# EAGLE schematic v847_redraw (EAGLE 9.6.0)
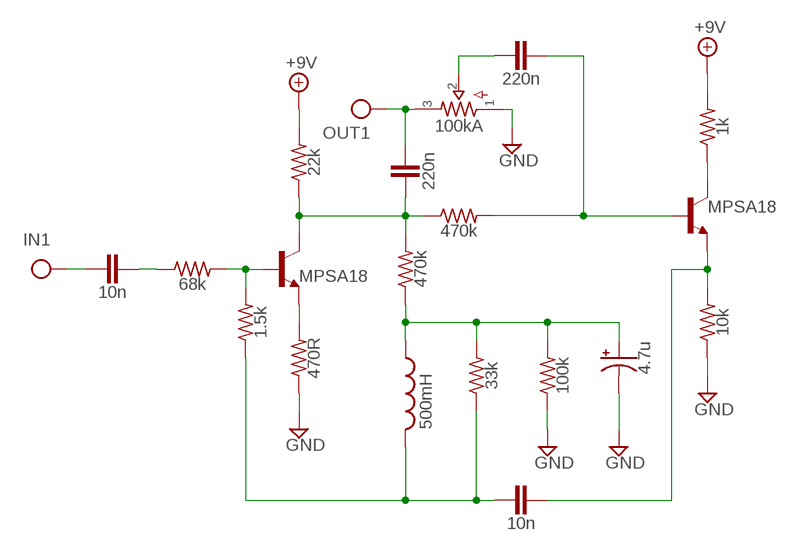
[diagram p0: schematic, sheet 1]

## Parts
C1  10n  CER/FILMBOX.1  [BOX_SMALL]
C106  220n  CER/FILM1  [050X030_025]
C107  220n  CER/FILMBOX.1  [BOX_SMALL]
C108  10n  CER/FILMBOX.1  [BOX_SMALL]
C109  4.7u  0500  [050_020]
L101  500mH  WAH  [WAH]
POT101  100kA  POTS16MM  [16MM]
Q102  MPSA18  [TO92-]
Q103  MPSA18  [TO92-]
R104  68k  R_.3B  [R0207/3]
R105  1.5k  R_.3B  [R0207/3]
R106  22k  R_.3B  [R0207/3]
R107  470R  R_.3B  [R0207/3]
R108  470k  R_.3B  [R0207/3]
R110  470k  R_.3B  [R0207/3]
R111  33k  R_.3B  [R0207/3]
R112  100k  R_.3B  [R0207/3]
R113  1k  R_.3B  [R0207/3]
R114  10k  R_.3B  [R0207/3]

## Nets
+9V: R106.2 R113.2
GND: C109.- POT101.1 R107.1 R112.1 R114.1
IN: C1.2
N$1: C1.1 R104.1
N$5: Q102.2(B) R104.2 R105.2
N$6: C106.2 Q102.1(C) R106.1 R108.2 R110.1
N$7: Q102.3(E) R107.2
N$9: C108.2 L101.2 R105.1 R111.1
N$10: C109.+ L101.1 R108.1 R111.2 R112.2
N$12: Q103.1(C) R113.1
N$13: C107.2 POT101.2
N$14: C107.1 Q103.2(B) R110.2
N$15: C108.1 Q103.3(E) R114.2
OUT: C106.1 POT101.3

## Library data of the parts
C1 C106-C108 = pedals-capacitors-film:CER/FILM: 47 - 120pF Xicon Ceramic Disc 2.5mm lead spacing
C109 = pedals-capacitors-elec:050
L101 = pedals-inductors:WAH: Wah Inductor pads placed on 0.4" x 0.4" spacing some packages use 0.3" x 0.3" spacing use template to fill in additional pads and traces as required
POT101 = pedals-potentiometers:POTS
Q102 Q103 = pedals-transistors:MPSA18
R104-R108 R110-R114 = pedals-resistors:R_